# EAGLE schematic type_2_signaling (EAGLE 9.6.2)
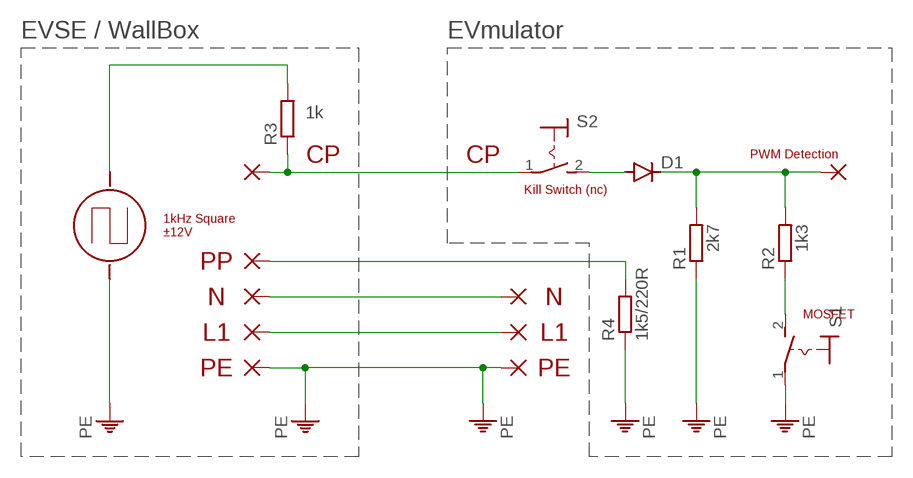
[diagram p0: schematic, sheet 1]

## Parts
D1  OA91  [DO07]
PAD1  1,6/0,8  [1,6/0,8]
PAD2  1,6/0,8  [1,6/0,8]
PAD3  1,6/0,8  [1,6/0,8]
PAD4  1,6/0,8  [1,6/0,8]
PAD5  1,6/0,8  [1,6/0,8]
PAD6  1,6/0,8  [1,6/0,8]
PAD7  1,6/0,8  [1,6/0,8]
PAD8  1,6/0,8  [1,6/0,8]
PAD9  1,6/0,8  [1,6/0,8]
R1  2k7  R-EU_0204/7  [0204/7]
R2  1k3  R-EU_0204/7  [0204/7]
R3  1k  R-EU_0204/7  [0204/7]
R4  1k5/220R  R-EU_0204/7  [0204/7]
S1  MS243  [MS243]
S2  MS243  [MS243]

## Nets
N$1: PAD1.1(P) R3.1 S2.1(P)
N$2: D1.C PAD2.1(P) R1.2 R2.2
N$3: R2.1 S1.2(S)
N$4: R3.2
N$5: D1.A S2.2(S)
N$6: PAD4.1(P) PAD6.1(P)
N$7: PAD3.1(P) PAD5.1(P)
N$8: PAD9.1(P) R4.2
PE: PAD7.1(P) PAD8.1(P) R1.1 R4.1 S1.1(P)

## Notes on the sheet
- EVSE / WallBox | EVmulator
- CP | CP | PWM Detection
- Kill Switch (nc)
- 1kHz Square
  ±12V
- PP
- N | N
- MOSFET
- L1 | L1
- PE | PE

## Library data of the parts
D1 = diode:OA91: DIODE germanium signal diode 115 V 50 mA
PAD1-PAD9 = wirepad:1,6/0,8: THROUGH-HOLE PAD
R1-R4 = rcl:R-EU_: RESISTOR, European symbol; SPICEPREFIX: R
S1 S2 = switch:MS243: TOGGLE SWITCH